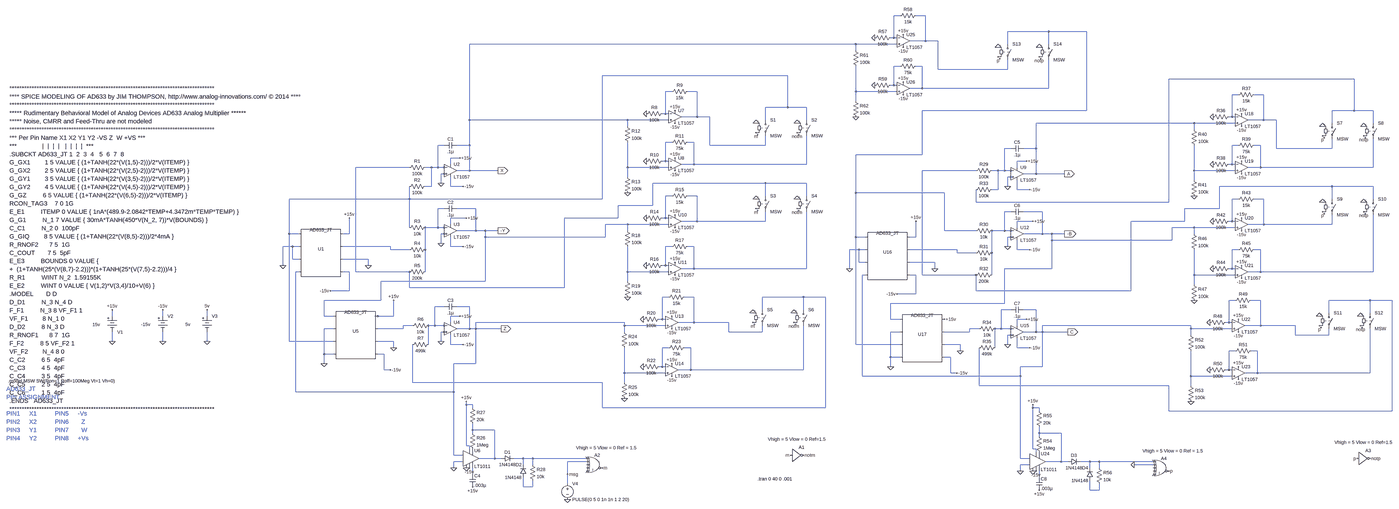
[diagram p0: schematic LORENZ_TS_Synchronize.asc, whole sheet]
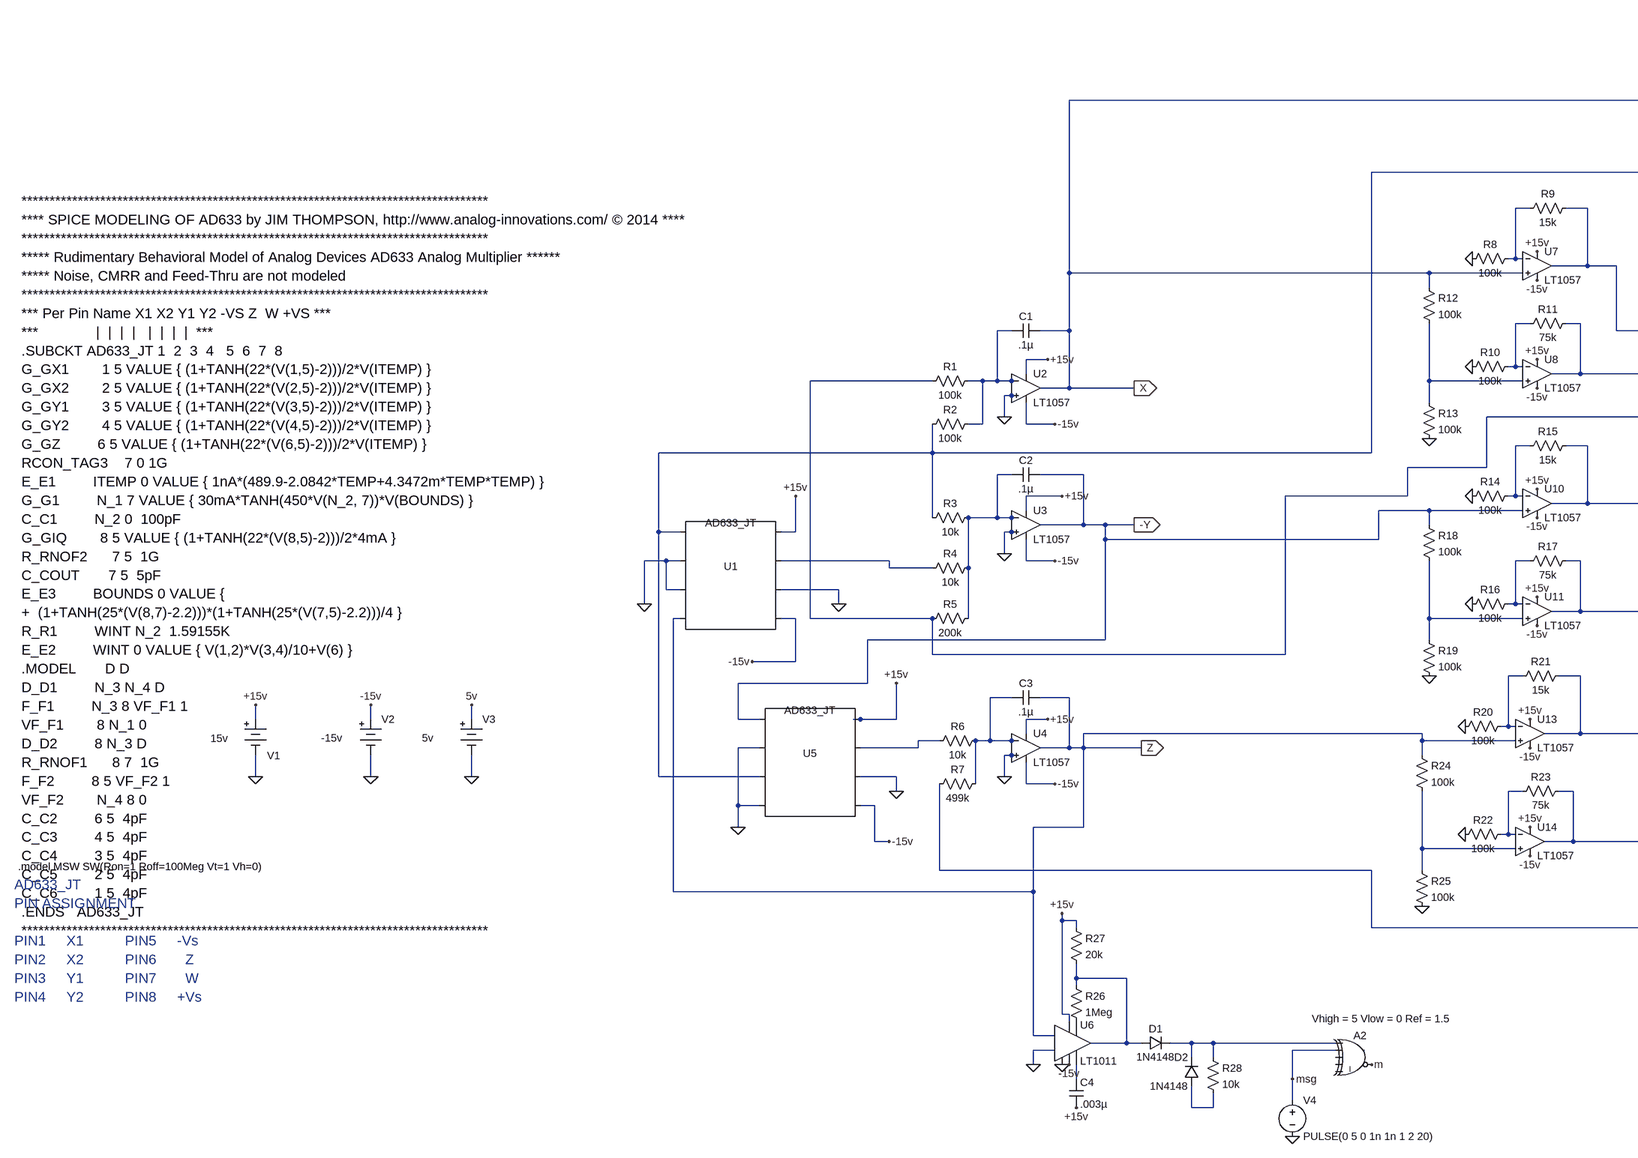
[diagram p1: schematic LORENZ_TS_Synchronize.asc, part, row 1 of 1, column 1 of 2]
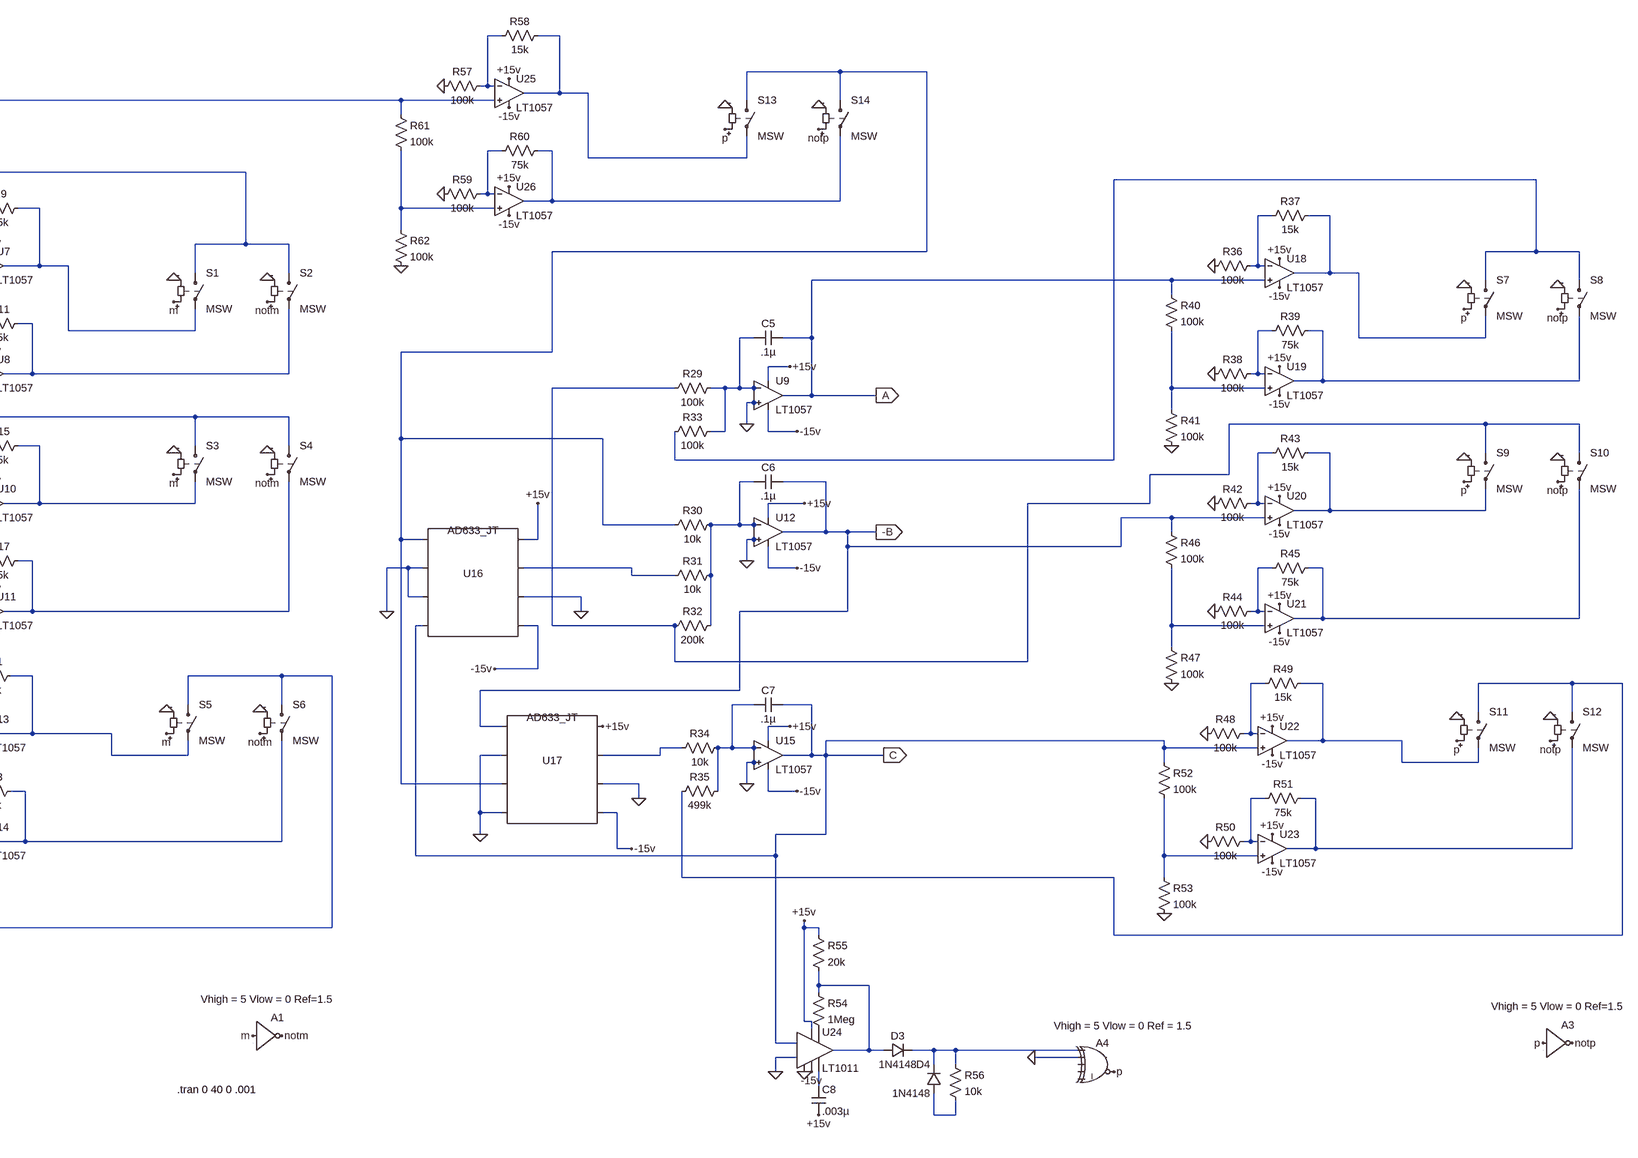
[diagram p2: schematic LORENZ_TS_Synchronize.asc, part, row 1 of 1, column 2 of 2]
LORENZ_TS_Synchronize.asc, the LTspice schematic file:
Version 4
SHEET 1 2280 3408
WIRE -336 -112 -368 -112
WIRE -208 -112 -256 -112
WIRE 416 -32 208 -32
WIRE 608 -32 416 -32
WIRE -368 0 -368 -112
WIRE -368 0 -384 0
WIRE -352 0 -368 0
WIRE -208 16 -208 -112
WIRE -208 16 -288 16
WIRE -144 16 -208 16
WIRE -560 32 -3312 32
WIRE -352 32 -560 32
WIRE 208 32 208 -32
WIRE 416 32 416 -32
WIRE -560 64 -560 32
WIRE -336 144 -368 144
WIRE -224 144 -256 144
WIRE -144 160 -144 16
WIRE 208 160 208 112
WIRE 208 160 -144 160
WIRE -1632 192 -2640 192
WIRE 2032 208 1024 208
WIRE -368 240 -368 144
WIRE -368 240 -384 240
WIRE -352 240 -368 240
WIRE -224 256 -224 144
WIRE -224 256 -288 256
WIRE 416 256 416 112
WIRE 416 256 -224 256
WIRE -2288 272 -2320 272
WIRE -2160 272 -2208 272
WIRE -560 272 -560 144
WIRE -352 272 -560 272
WIRE 1376 288 1344 288
WIRE 1504 288 1456 288
WIRE -560 320 -560 272
WIRE -1632 352 -1632 192
WIRE -1632 352 -1744 352
WIRE -1536 352 -1632 352
WIRE 608 368 608 -32
WIRE 608 368 -224 368
WIRE 2032 368 2032 208
WIRE 2032 368 1920 368
WIRE 2128 368 2032 368
WIRE -2320 384 -2320 272
WIRE -2320 384 -2336 384
WIRE -2304 384 -2320 384
WIRE -2160 400 -2160 272
WIRE -2160 400 -2240 400
WIRE -2096 400 -2160 400
WIRE 1344 400 1344 288
WIRE 1344 400 1328 400
WIRE 1360 400 1344 400
WIRE -3312 416 -3312 32
WIRE -2512 416 -3312 416
WIRE -2304 416 -2512 416
WIRE -1744 416 -1744 352
WIRE -1536 416 -1536 352
WIRE 1504 416 1504 288
WIRE 1504 416 1424 416
WIRE 1568 416 1504 416
WIRE 1152 432 352 432
WIRE 1360 432 1152 432
WIRE 1920 432 1920 368
WIRE 2128 432 2128 368
WIRE -2512 448 -2512 416
WIRE 1152 464 1152 432
WIRE -2288 528 -2320 528
WIRE -2176 528 -2208 528
WIRE -3440 544 -3472 544
WIRE -3312 544 -3312 416
WIRE -3312 544 -3376 544
WIRE -2096 544 -2096 400
WIRE -1744 544 -1744 496
WIRE -1744 544 -2096 544
WIRE 1376 544 1344 544
WIRE 1488 544 1456 544
WIRE 224 560 192 560
WIRE 352 560 352 432
WIRE 352 560 288 560
WIRE 1568 560 1568 416
WIRE 1920 560 1920 512
WIRE 1920 560 1568 560
WIRE -224 592 -224 368
WIRE -224 592 -560 592
WIRE -3360 608 -3408 608
WIRE -2320 624 -2320 528
WIRE -2320 624 -2336 624
WIRE -2304 624 -2320 624
WIRE 304 624 256 624
WIRE -3408 640 -3408 608
WIRE -2176 640 -2176 528
WIRE -2176 640 -2240 640
WIRE -1536 640 -1536 496
WIRE -1536 640 -2176 640
WIRE 1344 640 1344 544
WIRE 1344 640 1328 640
WIRE 1360 640 1344 640
WIRE -3616 656 -3888 656
WIRE -3504 656 -3536 656
WIRE -3472 656 -3472 544
WIRE -3472 656 -3504 656
WIRE -3440 656 -3472 656
WIRE -3424 656 -3440 656
WIRE -2512 656 -2512 528
WIRE -2304 656 -2512 656
WIRE 256 656 256 624
WIRE 1488 656 1488 544
WIRE 1488 656 1424 656
WIRE 2128 656 2128 512
WIRE 2128 656 1488 656
WIRE -3312 672 -3312 544
WIRE -3312 672 -3376 672
WIRE -3168 672 -3312 672
WIRE 48 672 -224 672
WIRE 160 672 128 672
WIRE 192 672 192 560
WIRE 192 672 160 672
WIRE 224 672 192 672
WIRE 240 672 224 672
WIRE 1152 672 1152 544
WIRE 1360 672 1152 672
WIRE -3440 688 -3456 688
WIRE 352 688 352 560
WIRE 352 688 288 688
WIRE 496 688 352 688
WIRE -3440 704 -3440 688
WIRE -2512 704 -2512 656
WIRE 224 704 208 704
WIRE 224 720 224 704
WIRE 1152 720 1152 672
WIRE -3456 736 -3456 688
WIRE -1744 736 -2384 736
WIRE -1536 736 -1744 736
WIRE -3504 752 -3504 656
WIRE -3504 752 -3536 752
WIRE -3408 752 -3408 704
WIRE -3344 752 -3408 752
WIRE 208 752 208 704
WIRE 1920 752 1280 752
WIRE 2128 752 1920 752
WIRE 160 768 160 672
WIRE 160 768 128 768
WIRE 256 768 256 720
WIRE 320 768 256 768
WIRE -560 784 -560 592
WIRE -112 784 -560 784
WIRE -2288 800 -2320 800
WIRE -2160 800 -2208 800
WIRE -1744 800 -1744 736
WIRE -1536 800 -1536 736
WIRE -3616 816 -3616 752
WIRE -3616 816 -4224 816
WIRE -2640 816 -2640 192
WIRE -2640 816 -3616 816
WIRE 1376 816 1344 816
WIRE 1504 816 1456 816
WIRE 1920 816 1920 752
WIRE 2128 816 2128 752
WIRE 48 832 48 768
WIRE 1024 832 1024 208
WIRE 1024 832 48 832
WIRE -2384 848 -2384 736
WIRE -2384 848 -2560 848
WIRE -3440 864 -3472 864
WIRE -3280 864 -3376 864
WIRE 1280 864 1280 752
WIRE 1280 864 1104 864
WIRE 224 880 192 880
WIRE 384 880 288 880
WIRE -3328 912 -3408 912
WIRE -2560 912 -2560 848
WIRE -2560 912 -2832 912
WIRE -2320 912 -2320 800
WIRE -2320 912 -2336 912
WIRE -2304 912 -2320 912
WIRE -2160 928 -2160 800
WIRE -2160 928 -2240 928
WIRE -1744 928 -1744 880
WIRE -1744 928 -2160 928
WIRE 336 928 256 928
WIRE 1104 928 1104 864
WIRE 1104 928 832 928
WIRE 1344 928 1344 816
WIRE 1344 928 1328 928
WIRE 1360 928 1344 928
WIRE -3408 944 -3408 912
WIRE -2512 944 -2624 944
WIRE -2304 944 -2512 944
WIRE 1504 944 1504 816
WIRE 1504 944 1424 944
WIRE 1920 944 1920 896
WIRE 1920 944 1504 944
WIRE -3616 960 -3616 816
WIRE -3472 960 -3472 864
WIRE -3472 960 -3536 960
WIRE -3440 960 -3472 960
WIRE -3424 960 -3440 960
WIRE 256 960 256 928
WIRE 1152 960 1040 960
WIRE 1360 960 1152 960
WIRE -3280 976 -3280 864
WIRE -3280 976 -3376 976
WIRE -3232 976 -3280 976
WIRE -3168 976 -3232 976
WIRE -2512 976 -2512 944
WIRE -112 976 -112 784
WIRE 48 976 -112 976
WIRE 192 976 192 880
WIRE 192 976 128 976
WIRE 224 976 192 976
WIRE 240 976 224 976
WIRE -4224 992 -4224 816
WIRE -4176 992 -4224 992
WIRE -3920 992 -3920 912
WIRE -3920 992 -3952 992
WIRE -3440 992 -3456 992
WIRE -3424 992 -3440 992
WIRE 384 992 384 880
WIRE 384 992 288 992
WIRE 432 992 384 992
WIRE 496 992 432 992
WIRE 1152 992 1152 960
WIRE -3232 1008 -3232 976
WIRE -2624 1008 -2624 944
WIRE -2624 1008 -3232 1008
WIRE -560 1008 -560 784
WIRE -512 1008 -560 1008
WIRE -256 1008 -256 928
WIRE -256 1008 -288 1008
WIRE 224 1008 208 1008
WIRE 240 1008 224 1008
WIRE 432 1024 432 992
WIRE 1040 1024 1040 960
WIRE 1040 1024 432 1024
WIRE -3456 1040 -3456 992
WIRE -4208 1056 -4256 1056
WIRE -4176 1056 -4208 1056
WIRE -3712 1056 -3952 1056
WIRE -3408 1056 -3408 1008
WIRE -3344 1056 -3408 1056
WIRE -2288 1056 -2320 1056
WIRE -2176 1056 -2208 1056
WIRE 208 1056 208 1008
WIRE -3712 1072 -3712 1056
WIRE -3616 1072 -3712 1072
WIRE -3536 1072 -3536 960
WIRE -544 1072 -592 1072
WIRE -512 1072 -544 1072
WIRE -48 1072 -288 1072
WIRE 256 1072 256 1024
WIRE 320 1072 256 1072
WIRE 1376 1072 1344 1072
WIRE 1488 1072 1456 1072
WIRE -48 1088 -48 1072
WIRE 48 1088 -48 1088
WIRE 128 1088 128 976
WIRE -4208 1120 -4208 1056
WIRE -4176 1120 -4208 1120
WIRE -3824 1120 -3952 1120
WIRE -544 1136 -544 1072
WIRE -512 1136 -544 1136
WIRE -160 1136 -288 1136
WIRE -4256 1152 -4256 1056
WIRE -3824 1152 -3824 1120
WIRE -2320 1152 -2320 1056
WIRE -2320 1152 -2336 1152
WIRE -2304 1152 -2320 1152
WIRE -2176 1168 -2176 1056
WIRE -2176 1168 -2240 1168
WIRE -1536 1168 -1536 880
WIRE -1536 1168 -2176 1168
WIRE -592 1168 -592 1072
WIRE -160 1168 -160 1136
WIRE 432 1168 432 1024
WIRE 432 1168 192 1168
WIRE 1344 1168 1344 1072
WIRE 1344 1168 1328 1168
WIRE 1360 1168 1344 1168
WIRE -4176 1184 -4192 1184
WIRE -3920 1184 -3952 1184
WIRE -3888 1184 -3888 656
WIRE -3616 1184 -3888 1184
WIRE -3536 1184 -3536 1072
WIRE -2512 1184 -2512 1056
WIRE -2304 1184 -2512 1184
WIRE 1488 1184 1488 1072
WIRE 1488 1184 1424 1184
WIRE 2128 1184 2128 896
WIRE 2128 1184 1488 1184
WIRE -512 1200 -528 1200
WIRE -256 1200 -288 1200
WIRE -224 1200 -224 672
WIRE 48 1200 -224 1200
WIRE 128 1200 128 1088
WIRE 1152 1200 1152 1072
WIRE 1360 1200 1152 1200
WIRE -3232 1232 -3232 1008
WIRE -3232 1232 -3760 1232
WIRE -2512 1232 -2512 1184
WIRE 1152 1248 1152 1200
WIRE -3616 1264 -3616 1184
WIRE -2832 1264 -2832 912
WIRE -2832 1264 -3616 1264
WIRE -3920 1280 -3920 1184
WIRE -3920 1280 -4016 1280
WIRE 48 1280 48 1200
WIRE 832 1280 832 928
WIRE 832 1280 48 1280
WIRE -256 1296 -256 1200
WIRE -256 1296 -352 1296
WIRE -2304 1312 -2336 1312
WIRE -2176 1312 -2224 1312
WIRE -1552 1312 -1760 1312
WIRE -1440 1312 -1552 1312
WIRE -3760 1328 -3760 1232
WIRE -3760 1328 -4048 1328
WIRE 1360 1328 1328 1328
WIRE 1488 1328 1440 1328
WIRE 2112 1328 1904 1328
WIRE 2224 1328 2112 1328
WIRE 192 1344 192 1168
WIRE 192 1344 -384 1344
WIRE -3440 1360 -3488 1360
WIRE -3312 1360 -3376 1360
WIRE -1760 1376 -1760 1312
WIRE -1552 1376 -1552 1312
WIRE 224 1376 176 1376
WIRE 352 1376 288 1376
WIRE 1904 1392 1904 1328
WIRE 2112 1392 2112 1328
WIRE -5120 1408 -5120 1376
WIRE -4864 1408 -4864 1376
WIRE -4640 1408 -4640 1376
WIRE -4048 1408 -4048 1328
WIRE -4000 1408 -4048 1408
WIRE -3776 1408 -3792 1408
WIRE -3696 1408 -3696 1328
WIRE -3696 1408 -3776 1408
WIRE -3360 1408 -3408 1408
WIRE -2336 1424 -2336 1312
WIRE -2336 1424 -2352 1424
WIRE -2320 1424 -2336 1424
WIRE -384 1424 -384 1344
WIRE -336 1424 -384 1424
WIRE 304 1424 256 1424
WIRE -3408 1440 -3408 1408
WIRE -2528 1440 -3280 1440
WIRE -2176 1440 -2176 1312
WIRE -2176 1440 -2256 1440
WIRE -2000 1440 -2176 1440
WIRE 1328 1440 1328 1328
WIRE 1328 1440 1312 1440
WIRE 1344 1440 1328 1440
WIRE -3600 1456 -3648 1456
WIRE -3488 1456 -3488 1360
WIRE -3488 1456 -3520 1456
WIRE -3440 1456 -3488 1456
WIRE -3424 1456 -3440 1456
WIRE -2528 1456 -2528 1440
WIRE -2320 1456 -2528 1456
WIRE 256 1456 256 1424
WIRE 1136 1456 384 1456
WIRE 1488 1456 1488 1328
WIRE 1488 1456 1408 1456
WIRE 1664 1456 1488 1456
WIRE -4000 1472 -4048 1472
WIRE -3648 1472 -3648 1456
WIRE -3648 1472 -3776 1472
WIRE -3312 1472 -3312 1360
WIRE -3312 1472 -3376 1472
WIRE -3280 1472 -3280 1440
WIRE -3280 1472 -3312 1472
WIRE -3152 1472 -3280 1472
WIRE 64 1472 16 1472
WIRE 176 1472 176 1376
WIRE 176 1472 144 1472
WIRE 224 1472 176 1472
WIRE 240 1472 224 1472
WIRE 1136 1472 1136 1456
WIRE 1344 1472 1136 1472
WIRE -3440 1488 -3456 1488
WIRE -3424 1488 -3440 1488
WIRE -2528 1488 -2528 1456
WIRE -2000 1488 -2000 1440
WIRE -1760 1488 -1760 1456
WIRE -1760 1488 -2000 1488
WIRE -336 1488 -384 1488
WIRE 16 1488 16 1472
WIRE 16 1488 -112 1488
WIRE 352 1488 352 1376
WIRE 352 1488 288 1488
WIRE 384 1488 384 1456
WIRE 384 1488 352 1488
WIRE 512 1488 384 1488
WIRE 224 1504 208 1504
WIRE 240 1504 224 1504
WIRE 1136 1504 1136 1472
WIRE 1664 1504 1664 1456
WIRE 1904 1504 1904 1472
WIRE 1904 1504 1664 1504
WIRE -5120 1536 -5120 1488
WIRE -4864 1536 -4864 1488
WIRE -4640 1536 -4640 1488
WIRE -4224 1536 -4224 992
WIRE -4000 1536 -4224 1536
WIRE -3696 1536 -3776 1536
WIRE -3456 1536 -3456 1488
WIRE -3520 1552 -3520 1456
WIRE -3408 1552 -3408 1504
WIRE -3344 1552 -3408 1552
WIRE -560 1552 -560 1008
WIRE -336 1552 -560 1552
WIRE -32 1552 -112 1552
WIRE 208 1552 208 1504
WIRE -3696 1568 -3696 1536
WIRE -2304 1568 -2336 1568
WIRE -2192 1568 -2224 1568
WIRE 144 1568 144 1472
WIRE 256 1568 256 1520
WIRE 320 1568 256 1568
WIRE -32 1584 -32 1552
WIRE 1360 1584 1328 1584
WIRE 1472 1584 1440 1584
WIRE -4048 1600 -4048 1472
WIRE -4000 1600 -4048 1600
WIRE -3744 1600 -3776 1600
WIRE -384 1616 -384 1488
WIRE -336 1616 -384 1616
WIRE -80 1616 -112 1616
WIRE -4048 1648 -4048 1600
WIRE -3280 1648 -3280 1472
WIRE -3280 1648 -3392 1648
WIRE -2336 1664 -2336 1568
WIRE -2336 1664 -2352 1664
WIRE -2320 1664 -2336 1664
WIRE -384 1664 -384 1616
WIRE 384 1664 384 1488
WIRE 384 1664 272 1664
WIRE -3744 1680 -3744 1600
WIRE -3712 1680 -3744 1680
WIRE -2192 1680 -2192 1568
WIRE -2192 1680 -2256 1680
WIRE -1552 1680 -1552 1456
WIRE -1552 1680 -2192 1680
WIRE 1328 1680 1328 1584
WIRE 1328 1680 1312 1680
WIRE 1344 1680 1328 1680
WIRE -2528 1696 -2528 1568
WIRE -2320 1696 -2528 1696
WIRE -80 1696 -80 1616
WIRE -48 1696 -80 1696
WIRE 1472 1696 1472 1584
WIRE 1472 1696 1408 1696
WIRE 2112 1696 2112 1472
WIRE 2112 1696 1472 1696
WIRE -528 1712 -528 1200
WIRE 272 1712 272 1664
WIRE 272 1712 -528 1712
WIRE 1136 1712 1136 1584
WIRE 1344 1712 1136 1712
WIRE -3600 1744 -3600 1552
WIRE -2640 1744 -3600 1744
WIRE -2528 1744 -2528 1696
WIRE 64 1760 64 1568
WIRE 1024 1760 64 1760
WIRE 1136 1760 1136 1712
WIRE -4192 1792 -4192 1184
WIRE -3392 1792 -3392 1648
WIRE -3392 1792 -4192 1792
WIRE -3328 1856 -3328 1840
WIRE -3296 1856 -3328 1856
WIRE -3296 1872 -3296 1856
WIRE -2640 1872 -2640 1744
WIRE -1440 1872 -1440 1312
WIRE -1440 1872 -2640 1872
WIRE 336 1872 336 1856
WIRE 368 1872 336 1872
WIRE 368 1888 368 1872
WIRE 1024 1888 1024 1760
WIRE 2224 1888 2224 1328
WIRE 2224 1888 1024 1888
WIRE -3296 1984 -3296 1952
WIRE -3184 1984 -3296 1984
WIRE -3296 2000 -3296 1984
WIRE 368 2000 368 1968
WIRE 480 2000 368 2000
WIRE 368 2016 368 2000
WIRE -3328 2064 -3328 1856
WIRE -3312 2064 -3328 2064
WIRE -3312 2080 -3312 2064
WIRE 336 2080 336 1872
WIRE 352 2080 336 2080
WIRE 352 2096 352 2080
WIRE -3392 2112 -3392 1792
WIRE -3344 2112 -3392 2112
WIRE -3184 2128 -3184 1984
WIRE -3184 2128 -3264 2128
WIRE -3152 2128 -3184 2128
WIRE -3040 2128 -3088 2128
WIRE -2992 2128 -3040 2128
WIRE -2720 2128 -2992 2128
WIRE 272 2128 272 1712
WIRE 320 2128 272 2128
WIRE -3344 2144 -3392 2144
WIRE -2720 2144 -2816 2144
WIRE 480 2144 480 2000
WIRE 480 2144 400 2144
WIRE 512 2144 480 2144
WIRE 624 2144 576 2144
WIRE 672 2144 624 2144
WIRE 944 2144 672 2144
WIRE -3040 2160 -3040 2128
WIRE -2992 2160 -2992 2128
WIRE 320 2160 272 2160
WIRE 944 2160 848 2160
WIRE -3392 2176 -3392 2144
WIRE 624 2176 624 2144
WIRE 672 2176 672 2144
WIRE 272 2192 272 2160
WIRE -3296 2208 -3296 2176
WIRE -2816 2208 -2816 2144
WIRE 368 2224 368 2192
WIRE -2816 2256 -2816 2208
WIRE -3040 2272 -3040 2224
WIRE -2992 2272 -2992 2240
WIRE -2992 2272 -3040 2272
WIRE 624 2288 624 2240
WIRE 672 2288 672 2256
WIRE 672 2288 624 2288
FLAG -3168 672 X
IOPIN -3168 672 Out
FLAG -3152 1472 Z
IOPIN -3152 1472 Out
FLAG -3456 736 0
FLAG -3456 1040 0
FLAG -3456 1536 0
FLAG -5120 1536 0
FLAG -4864 1536 0
FLAG -3168 976 -Y
IOPIN -3168 976 Out
FLAG -5120 1376 +15v
FLAG -3360 1408 +15v
FLAG -3328 912 +15v
FLAG -3360 608 +15v
FLAG -4864 1376 -15v
FLAG -3344 1552 -15v
FLAG -3344 1056 -15v
FLAG -3344 752 -15v
FLAG -3920 912 +15v
FLAG -3696 1328 +15v
FLAG -3712 1680 -15v
FLAG -4016 1280 -15v
FLAG -3696 1568 0
FLAG -3824 1152 0
FLAG -4256 1152 0
FLAG -4048 1648 0
FLAG -4640 1536 0
FLAG -4640 1376 5v
FLAG -2272 608 +15v
FLAG -2272 368 +15v
FLAG -2272 672 -15v
FLAG -2272 432 -15v
FLAG -2416 624 0
FLAG -2416 384 0
FLAG -2512 784 0
FLAG -2816 2336 0
FLAG -2272 1136 +15v
FLAG -2272 896 +15v
FLAG -2272 1200 -15v
FLAG -2272 960 -15v
FLAG -2416 1152 0
FLAG -2416 912 0
FLAG -2512 1312 0
FLAG -2288 1648 +15v
FLAG -2288 1408 +15v
FLAG -2288 1712 -15v
FLAG -2288 1472 -15v
FLAG -2432 1664 0
FLAG -2432 1424 0
FLAG -2528 1824 0
FLAG -1616 2112 m
FLAG -1552 2112 notm
FLAG -1792 432 0
FLAG -1584 432 0
FLAG -1792 480 m
FLAG -1584 480 notm
FLAG -1792 816 0
FLAG -1584 816 0
FLAG -1792 864 m
FLAG -1584 864 notm
FLAG -1808 1392 0
FLAG -1600 1392 0
FLAG -1808 1440 m
FLAG -1600 1440 notm
FLAG -3328 1840 +15v
FLAG -3312 2176 -15v
FLAG -3296 2272 +15v
FLAG -3328 2176 0
FLAG -3392 2176 0
FLAG -2640 2176 m
FLAG 496 688 A
IOPIN 496 688 Out
FLAG 512 1488 C
IOPIN 512 1488 Out
FLAG 208 752 0
FLAG 208 1056 0
FLAG 208 1552 0
FLAG 496 992 -B
IOPIN 496 992 Out
FLAG 304 1424 +15v
FLAG 336 928 +15v
FLAG 304 624 +15v
FLAG 320 1568 -15v
FLAG 320 1072 -15v
FLAG 320 768 -15v
FLAG -256 928 +15v
FLAG -48 1696 -15v
FLAG -352 1296 -15v
FLAG -32 1584 0
FLAG -160 1168 0
FLAG -592 1168 0
FLAG -384 1664 0
FLAG 1392 624 +15v
FLAG 1392 384 +15v
FLAG 1392 688 -15v
FLAG 1392 448 -15v
FLAG 1248 640 0
FLAG 1248 400 0
FLAG 1152 800 0
FLAG 1392 1152 +15v
FLAG 1392 912 +15v
FLAG 1392 1216 -15v
FLAG 1392 976 -15v
FLAG 1248 1168 0
FLAG 1248 928 0
FLAG 1152 1328 0
FLAG 1376 1664 +15v
FLAG 1376 1424 +15v
FLAG 1376 1728 -15v
FLAG 1376 1488 -15v
FLAG 1232 1680 0
FLAG 1232 1440 0
FLAG 1136 1840 0
FLAG 2048 2128 p
FLAG 2112 2128 notp
FLAG 1872 448 0
FLAG 2080 448 0
FLAG 1872 496 p
FLAG 2080 496 notp
FLAG 1872 832 0
FLAG 2080 832 0
FLAG 1872 880 p
FLAG 2080 880 notp
FLAG 1856 1408 0
FLAG 2064 1408 0
FLAG 1856 1456 p
FLAG 2064 1456 notp
FLAG 336 1856 +15v
FLAG 352 2192 -15v
FLAG 368 2288 +15v
FLAG 336 2192 0
FLAG 272 2192 0
FLAG 1024 2192 p
FLAG 848 2160 0
FLAG -320 224 +15v
FLAG -320 -16 +15v
FLAG -320 288 -15v
FLAG -320 48 -15v
FLAG -464 240 0
FLAG -464 0 0
FLAG -560 400 0
FLAG 160 48 0
FLAG 368 48 0
FLAG 160 96 p
FLAG 368 96 notp
FLAG -112 1424 +15v
FLAG -2816 2208 msg
SYMBOL Opamps\\LT1057 -3408 608 R0
SYMATTR InstName U2
SYMBOL Opamps\\LT1057 -3408 912 R0
SYMATTR InstName U3
SYMBOL Opamps\\LT1057 -3408 1408 R0
SYMATTR InstName U4
SYMBOL res -3632 672 R270
WINDOW 0 32 56 VTop 2
WINDOW 3 0 56 VBottom 2
SYMATTR InstName R1
SYMATTR Value 100k
SYMATTR SpiceLine tol=1
SYMBOL res -3632 976 R270
WINDOW 0 32 56 VTop 2
WINDOW 3 0 56 VBottom 2
SYMATTR InstName R3
SYMATTR Value 10k
SYMATTR SpiceLine tol=1
SYMBOL res -3632 1088 R270
WINDOW 0 32 56 VTop 2
WINDOW 3 0 56 VBottom 2
SYMATTR InstName R4
SYMATTR Value 10k
SYMATTR SpiceLine tol=1
SYMBOL res -3632 1200 R270
WINDOW 0 32 56 VTop 2
WINDOW 3 0 56 VBottom 2
SYMATTR InstName R5
SYMATTR Value 200k
SYMATTR SpiceLine tol=1
SYMBOL res -3632 768 R270
WINDOW 0 32 56 VTop 2
WINDOW 3 0 56 VBottom 2
SYMATTR InstName R2
SYMATTR Value 100k
SYMATTR SpiceLine tol=1
SYMBOL cap -3440 560 R270
WINDOW 0 32 32 VTop 2
WINDOW 3 0 32 VBottom 2
SYMATTR InstName C1
SYMATTR Value .1µ
SYMBOL cap -3440 880 R270
WINDOW 0 32 32 VTop 2
WINDOW 3 0 32 VBottom 2
SYMATTR InstName C2
SYMATTR Value .1µ
SYMBOL cap -3440 1376 R270
WINDOW 0 32 32 VTop 2
WINDOW 3 0 32 VBottom 2
SYMATTR InstName C3
SYMATTR Value .1µ
SYMBOL res -3616 1472 R270
WINDOW 0 32 56 VTop 2
WINDOW 3 0 56 VBottom 2
SYMATTR InstName R6
SYMATTR Value 10k
SYMATTR SpiceLine tol=1
SYMBOL res -3616 1568 R270
WINDOW 0 32 56 VTop 2
WINDOW 3 0 56 VBottom 2
SYMATTR InstName R7
SYMATTR Value 499k
SYMATTR SpiceLine tol=1
SYMBOL Misc\\battery -5120 1392 R0
WINDOW 0 26 97 Left 2
WINDOW 3 -100 59 Left 2
WINDOW 123 0 0 Left 2
WINDOW 39 0 0 Left 2
SYMATTR InstName V1
SYMATTR Value 15v
SYMBOL Misc\\battery -4864 1392 R0
WINDOW 3 -110 58 Left 2
WINDOW 123 0 0 Left 2
WINDOW 39 0 0 Left 2
SYMATTR Value -15v
SYMATTR InstName V2
SYMBOL Misc\\DIP8 -4064 1088 R0
WINDOW 3 0 -116 Center 2
SYMATTR Value AD633_JT
SYMATTR InstName U1
SYMBOL Misc\\DIP8 -3888 1504 R0
WINDOW 3 0 -116 Center 2
SYMATTR Value AD633_JT
SYMATTR InstName U5
SYMBOL Misc\\battery -4640 1392 R0
WINDOW 3 -110 58 Left 2
WINDOW 123 0 0 Left 2
WINDOW 39 0 0 Left 2
SYMATTR Value 5v
SYMATTR InstName V3
SYMBOL Opamps\\LT1057 -2272 336 R0
SYMATTR InstName U7
SYMBOL Opamps\\LT1057 -2272 576 R0
SYMATTR InstName U8
SYMBOL res -2320 368 R90
WINDOW 0 0 56 VBottom 2
WINDOW 3 32 56 VTop 2
SYMATTR InstName R8
SYMATTR Value 100k
SYMBOL res -2192 256 R90
WINDOW 0 0 56 VBottom 2
WINDOW 3 32 56 VTop 2
SYMATTR InstName R9
SYMATTR Value 15k
SYMBOL res -2320 608 R90
WINDOW 0 0 56 VBottom 2
WINDOW 3 32 56 VTop 2
SYMATTR InstName R10
SYMATTR Value 100k
SYMBOL res -2192 512 R90
WINDOW 0 0 56 VBottom 2
WINDOW 3 32 56 VTop 2
SYMATTR InstName R11
SYMATTR Value 75k
SYMBOL res -2528 432 R0
SYMATTR InstName R12
SYMATTR Value 100k
SYMBOL res -2528 688 R0
SYMATTR InstName R13
SYMATTR Value 100k
SYMBOL voltage -2816 2240 R0
WINDOW 123 0 0 Left 2
WINDOW 39 0 0 Left 2
SYMATTR InstName V4
SYMATTR Value PULSE(0 5 0 1n 1n 1 2 20)
SYMBOL Opamps\\LT1057 -2272 864 R0
SYMATTR InstName U10
SYMBOL Opamps\\LT1057 -2272 1104 R0
SYMATTR InstName U11
SYMBOL res -2320 896 R90
WINDOW 0 0 56 VBottom 2
WINDOW 3 32 56 VTop 2
SYMATTR InstName R14
SYMATTR Value 100k
SYMBOL res -2192 784 R90
WINDOW 0 0 56 VBottom 2
WINDOW 3 32 56 VTop 2
SYMATTR InstName R15
SYMATTR Value 15k
SYMBOL res -2320 1136 R90
WINDOW 0 0 56 VBottom 2
WINDOW 3 32 56 VTop 2
SYMATTR InstName R16
SYMATTR Value 100k
SYMBOL res -2192 1040 R90
WINDOW 0 0 56 VBottom 2
WINDOW 3 32 56 VTop 2
SYMATTR InstName R17
SYMATTR Value 75k
SYMBOL res -2528 960 R0
SYMATTR InstName R18
SYMATTR Value 100k
SYMBOL res -2528 1216 R0
SYMATTR InstName R19
SYMATTR Value 100k
SYMBOL Opamps\\LT1057 -2288 1376 R0
SYMATTR InstName U13
SYMBOL Opamps\\LT1057 -2288 1616 R0
SYMATTR InstName U14
SYMBOL res -2336 1408 R90
WINDOW 0 0 56 VBottom 2
WINDOW 3 32 56 VTop 2
SYMATTR InstName R20
SYMATTR Value 100k
SYMBOL res -2208 1296 R90
WINDOW 0 0 56 VBottom 2
WINDOW 3 32 56 VTop 2
SYMATTR InstName R21
SYMATTR Value 15k
SYMBOL res -2336 1648 R90
WINDOW 0 0 56 VBottom 2
WINDOW 3 32 56 VTop 2
SYMATTR InstName R22
SYMATTR Value 100k
SYMBOL res -2208 1552 R90
WINDOW 0 0 56 VBottom 2
WINDOW 3 32 56 VTop 2
SYMATTR InstName R23
SYMATTR Value 75k
SYMBOL res -2544 1472 R0
SYMATTR InstName R24
SYMATTR Value 100k
SYMBOL res -2544 1728 R0
SYMATTR InstName R25
SYMATTR Value 100k
SYMBOL sw -1744 400 R0
SYMATTR InstName S1
SYMATTR Value MSW
SYMBOL Digital\\inv -1616 2048 R0
WINDOW 3 -116 -17 Left 2
SYMATTR Value Vhigh = 5 Vlow = 0 Ref=1.5
SYMATTR InstName A1
SYMATTR Value2 Trise = 1n Tfall = 1n Td =1n
SYMBOL sw -1536 400 R0
SYMATTR InstName S2
SYMATTR Value MSW
SYMBOL sw -1744 784 R0
SYMATTR InstName S3
SYMATTR Value MSW
SYMBOL sw -1536 784 R0
SYMATTR InstName S4
SYMATTR Value MSW
SYMBOL sw -1760 1360 R0
SYMATTR InstName S5
SYMATTR Value MSW
SYMBOL sw -1552 1360 R0
SYMATTR InstName S6
SYMATTR Value MSW
SYMBOL Comparators\\LT1011 -3312 2128 R0
SYMATTR InstName U6
SYMBOL res -3312 1984 R0
SYMATTR InstName R26
SYMATTR Value 1Meg
SYMBOL res -3312 1856 R0
SYMATTR InstName R27
SYMATTR Value 20k
SYMBOL cap -3312 2208 R0
SYMATTR InstName C4
SYMATTR Value .003µ
SYMBOL diode -3152 2144 R270
WINDOW 0 32 32 VTop 2
WINDOW 3 0 32 VBottom 2
SYMATTR InstName D1
SYMATTR Value 1N4148
SYMBOL diode -3024 2224 R180
WINDOW 0 24 64 Left 2
WINDOW 3 24 0 Left 2
SYMATTR InstName D2
SYMATTR Value 1N4148
SYMBOL res -3008 2144 R0
SYMATTR InstName R28
SYMATTR Value 10k
SYMBOL Digital\\xor -2672 2096 R0
WINDOW 3 -101 -22 Left 2
SYMATTR Value Vhigh = 5 Vlow = 0 Ref = 1.5
SYMATTR InstName A2
SYMBOL Opamps\\LT1057 256 624 R0
SYMATTR InstName U9
SYMBOL Opamps\\LT1057 256 928 R0
SYMATTR InstName U12
SYMBOL Opamps\\LT1057 256 1424 R0
SYMATTR InstName U15
SYMBOL res 32 688 R270
WINDOW 0 32 56 VTop 2
WINDOW 3 0 56 VBottom 2
SYMATTR InstName R29
SYMATTR Value 100k
SYMATTR SpiceLine tol=1
SYMBOL res 32 992 R270
WINDOW 0 32 56 VTop 2
WINDOW 3 0 56 VBottom 2
SYMATTR InstName R30
SYMATTR Value 10k
SYMATTR SpiceLine tol=1
SYMBOL res 32 1104 R270
WINDOW 0 32 56 VTop 2
WINDOW 3 0 56 VBottom 2
SYMATTR InstName R31
SYMATTR Value 10k
SYMATTR SpiceLine tol=1
SYMBOL res 32 1216 R270
WINDOW 0 32 56 VTop 2
WINDOW 3 0 56 VBottom 2
SYMATTR InstName R32
SYMATTR Value 200k
SYMATTR SpiceLine tol=1
SYMBOL res 32 784 R270
WINDOW 0 32 56 VTop 2
WINDOW 3 0 56 VBottom 2
SYMATTR InstName R33
SYMATTR Value 100k
SYMATTR SpiceLine tol=1
SYMBOL cap 224 576 R270
WINDOW 0 32 32 VTop 2
WINDOW 3 0 32 VBottom 2
SYMATTR InstName C5
SYMATTR Value .1µ
SYMBOL cap 224 896 R270
WINDOW 0 32 32 VTop 2
WINDOW 3 0 32 VBottom 2
SYMATTR InstName C6
SYMATTR Value .1µ
SYMBOL cap 224 1392 R270
WINDOW 0 32 32 VTop 2
WINDOW 3 0 32 VBottom 2
SYMATTR InstName C7
SYMATTR Value .1µ
SYMBOL res 48 1488 R270
WINDOW 0 32 56 VTop 2
WINDOW 3 0 56 VBottom 2
SYMATTR InstName R34
SYMATTR Value 10k
SYMATTR SpiceLine tol=1
SYMBOL res 48 1584 R270
WINDOW 0 32 56 VTop 2
WINDOW 3 0 56 VBottom 2
SYMATTR InstName R35
SYMATTR Value 499k
SYMATTR SpiceLine tol=1
SYMBOL Misc\\DIP8 -400 1104 R0
WINDOW 3 0 -116 Center 2
SYMATTR Value AD633_JT
SYMATTR InstName U16
SYMBOL Misc\\DIP8 -224 1520 R0
WINDOW 3 0 -116 Center 2
SYMATTR Value AD633_JT
SYMATTR InstName U17
SYMBOL Opamps\\LT1057 1392 352 R0
SYMATTR InstName U18
SYMBOL Opamps\\LT1057 1392 592 R0
SYMATTR InstName U19
SYMBOL res 1344 384 R90
WINDOW 0 0 56 VBottom 2
WINDOW 3 32 56 VTop 2
SYMATTR InstName R36
SYMATTR Value 100k
SYMBOL res 1472 272 R90
WINDOW 0 0 56 VBottom 2
WINDOW 3 32 56 VTop 2
SYMATTR InstName R37
SYMATTR Value 15k
SYMBOL res 1344 624 R90
WINDOW 0 0 56 VBottom 2
WINDOW 3 32 56 VTop 2
SYMATTR InstName R38
SYMATTR Value 100k
SYMBOL res 1472 528 R90
WINDOW 0 0 56 VBottom 2
WINDOW 3 32 56 VTop 2
SYMATTR InstName R39
SYMATTR Value 75k
SYMBOL res 1136 448 R0
SYMATTR InstName R40
SYMATTR Value 100k
SYMBOL res 1136 704 R0
SYMATTR InstName R41
SYMATTR Value 100k
SYMBOL Opamps\\LT1057 1392 880 R0
SYMATTR InstName U20
SYMBOL Opamps\\LT1057 1392 1120 R0
SYMATTR InstName U21
SYMBOL res 1344 912 R90
WINDOW 0 0 56 VBottom 2
WINDOW 3 32 56 VTop 2
SYMATTR InstName R42
SYMATTR Value 100k
SYMBOL res 1472 800 R90
WINDOW 0 0 56 VBottom 2
WINDOW 3 32 56 VTop 2
SYMATTR InstName R43
SYMATTR Value 15k
SYMBOL res 1344 1152 R90
WINDOW 0 0 56 VBottom 2
WINDOW 3 32 56 VTop 2
SYMATTR InstName R44
SYMATTR Value 100k
SYMBOL res 1472 1056 R90
WINDOW 0 0 56 VBottom 2
WINDOW 3 32 56 VTop 2
SYMATTR InstName R45
SYMATTR Value 75k
SYMBOL res 1136 976 R0
SYMATTR InstName R46
SYMATTR Value 100k
SYMBOL res 1136 1232 R0
SYMATTR InstName R47
SYMATTR Value 100k
SYMBOL Opamps\\LT1057 1376 1392 R0
SYMATTR InstName U22
SYMBOL Opamps\\LT1057 1376 1632 R0
SYMATTR InstName U23
SYMBOL res 1328 1424 R90
WINDOW 0 0 56 VBottom 2
WINDOW 3 32 56 VTop 2
SYMATTR InstName R48
SYMATTR Value 100k
SYMBOL res 1456 1312 R90
WINDOW 0 0 56 VBottom 2
WINDOW 3 32 56 VTop 2
SYMATTR InstName R49
SYMATTR Value 15k
SYMBOL res 1328 1664 R90
WINDOW 0 0 56 VBottom 2
WINDOW 3 32 56 VTop 2
SYMATTR InstName R50
SYMATTR Value 100k
SYMBOL res 1456 1568 R90
WINDOW 0 0 56 VBottom 2
WINDOW 3 32 56 VTop 2
SYMATTR InstName R51
SYMATTR Value 75k
SYMBOL res 1120 1488 R0
SYMATTR InstName R52
SYMATTR Value 100k
SYMBOL res 1120 1744 R0
SYMATTR InstName R53
SYMATTR Value 100k
SYMBOL sw 1920 416 R0
SYMATTR InstName S7
SYMATTR Value MSW
SYMBOL Digital\\inv 2048 2064 R0
WINDOW 3 -116 -17 Left 2
SYMATTR Value Vhigh = 5 Vlow = 0 Ref=1.5
SYMATTR InstName A3
SYMATTR Value2 Trise = 1n Tfall = 1n Td =1n
SYMBOL sw 2128 416 R0
SYMATTR InstName S8
SYMATTR Value MSW
SYMBOL sw 1920 800 R0
SYMATTR InstName S9
SYMATTR Value MSW
SYMBOL sw 2128 800 R0
SYMATTR InstName S10
SYMATTR Value MSW
SYMBOL sw 1904 1376 R0
SYMATTR InstName S11
SYMATTR Value MSW
SYMBOL sw 2112 1376 R0
SYMATTR InstName S12
SYMATTR Value MSW
SYMBOL Comparators\\LT1011 352 2144 R0
SYMATTR InstName U24
SYMBOL res 352 2000 R0
SYMATTR InstName R54
SYMATTR Value 1Meg
SYMBOL res 352 1872 R0
SYMATTR InstName R55
SYMATTR Value 20k
SYMBOL cap 352 2224 R0
SYMATTR InstName C8
SYMATTR Value .003µ
SYMBOL diode 512 2160 R270
WINDOW 0 32 32 VTop 2
WINDOW 3 0 32 VBottom 2
SYMATTR InstName D3
SYMATTR Value 1N4148
SYMBOL diode 640 2240 R180
WINDOW 0 24 64 Left 2
WINDOW 3 24 0 Left 2
SYMATTR InstName D4
SYMATTR Value 1N4148
SYMBOL res 656 2160 R0
SYMATTR InstName R56
SYMATTR Value 10k
SYMBOL Digital\\xor 992 2112 R0
WINDOW 3 -101 -22 Left 2
SYMATTR Value Vhigh = 5 Vlow = 0 Ref = 1.5
SYMATTR InstName A4
SYMBOL Opamps\\LT1057 -320 -48 R0
SYMATTR InstName U25
SYMBOL Opamps\\LT1057 -320 192 R0
SYMATTR InstName U26
SYMBOL res -368 -16 R90
WINDOW 0 0 56 VBottom 2
WINDOW 3 32 56 VTop 2
SYMATTR InstName R57
SYMATTR Value 100k
SYMBOL res -240 -128 R90
WINDOW 0 0 56 VBottom 2
WINDOW 3 32 56 VTop 2
SYMATTR InstName R58
SYMATTR Value 15k
SYMBOL res -368 224 R90
WINDOW 0 0 56 VBottom 2
WINDOW 3 32 56 VTop 2
SYMATTR InstName R59
SYMATTR Value 100k
SYMBOL res -240 128 R90
WINDOW 0 0 56 VBottom 2
WINDOW 3 32 56 VTop 2
SYMATTR InstName R60
SYMATTR Value 75k
SYMBOL res -576 48 R0
SYMATTR InstName R61
SYMATTR Value 100k
SYMBOL res -576 304 R0
SYMATTR InstName R62
SYMATTR Value 100k
SYMBOL sw 208 16 R0
SYMATTR InstName S13
SYMATTR Value MSW
SYMBOL sw 416 16 R0
SYMATTR InstName S14
SYMATTR Value MSW
TEXT -1784 2232 Left 2 !.tran 0 40 0 .001
TEXT -5640 256 Left 3 !***********************************************************************************\n**** SPICE MODELING OF AD633 by JIM THOMPSON, http://www.analog-innovations.com/ © 2014 ****\n***********************************************************************************\n***** Rudimentary Behavioral Model of Analog Devices AD633 Analog Multiplier ******\n***** Noise, CMRR and Feed-Thru are not modeled\n***********************************************************************************\n*** Per Pin Name X1 X2 Y1 Y2 -VS Z  W +VS ***\n***              |  |  |  |   |  |  |  |  ***\n.SUBCKT AD633_JT 1  2  3  4   5  6  7  8 \nG_GX1        1 5 VALUE { (1+TANH(22*(V(1,5)-2)))/2*V(ITEMP) }\nG_GX2        2 5 VALUE { (1+TANH(22*(V(2,5)-2)))/2*V(ITEMP) }\nG_GY1        3 5 VALUE { (1+TANH(22*(V(3,5)-2)))/2*V(ITEMP) }\nG_GY2        4 5 VALUE { (1+TANH(22*(V(4,5)-2)))/2*V(ITEMP) }\nG_GZ         6 5 VALUE { (1+TANH(22*(V(6,5)-2)))/2*V(ITEMP) }\nRCON_TAG3    7 0 1G\nE_E1         ITEMP 0 VALUE { 1nA*(489.9-2.0842*TEMP+4.3472m*TEMP*TEMP) }\nG_G1         N_1 7 VALUE { 30mA*TANH(450*V(N_2, 7))*V(BOUNDS) }\nC_C1         N_2 0  100pF \nG_GIQ        8 5 VALUE { (1+TANH(22*(V(8,5)-2)))/2*4mA }\nR_RNOF2      7 5  1G \nC_COUT       7 5  5pF \nE_E3         BOUNDS 0 VALUE {\n+  (1+TANH(25*(V(8,7)-2.2)))*(1+TANH(25*(V(7,5)-2.2)))/4 }\nR_R1         WINT N_2  1.59155K \nE_E2         WINT 0 VALUE { V(1,2)*V(3,4)/10+V(6) }\n.MODEL       D D\nD_D1         N_3 N_4 D \nF_F1         N_3 8 VF_F1 1\nVF_F1        8 N_1 0\nD_D2         8 N_3 D \nR_RNOF1      8 7  1G \nF_F2         8 5 VF_F2 1\nVF_F2        N_4 8 0\nC_C2         6 5  4pF \nC_C3         4 5  4pF \nC_C4         3 5  4pF \nC_C5         2 5  4pF \nC_C6         1 5  4pF \n.ENDS   AD633_JT\n***********************************************************************************
TEXT -5656 1776 Left 3 ;AD633_JT\nPIN ASSIGNMENT\n \nPIN1     X1          PIN5     -Vs\nPIN2     X2          PIN6       Z\nPIN3     Y1          PIN7       W\nPIN4     Y2          PIN8     +Vs
TEXT -5648 1736 Left 2 !.model MSW SW(Ron=1 Roff=100Meg Vt=1 Vh=0)

The netlist it stands for:
* LORENZ_TS_Synchronize.asc
XU2 0 N015 +15v -15v X LT1057  ; pins In+ In- V+ V- OUT
XU3 0 N027 +15v -15v -Y LT1057  ; pins In+ In- V+ V- OUT
XU4 0 N043 +15v -15v Z LT1057  ; pins In+ In- V+ V- OUT
R1 N019 N015 100k tol=1
R3 N006 N027 10k tol=1
R4 N029 N027 10k tol=1
R5 N019 N027 200k tol=1
R2 N006 N015 100k tol=1
C1 N015 X .1µ
C2 N027 -Y .1µ
C3 N043 Z .1µ
R6 N045 N043 10k tol=1
R7 N039 N043 499k tol=1
V1 +15v 0 15v
V2 -15v 0 -15v
XU1 N006 0 0 Z -15v 0 N029 +15v AD633_JT
XU5 -Y 0 N006 0 -15v 0 N045 +15v AD633_JT
V3 5v 0 5v
XU7 X N008 +15v -15v N009 LT1057  ; pins In+ In- V+ V- OUT
XU8 N020 N013 +15v -15v N014 LT1057  ; pins In+ In- V+ V- OUT
R8 N008 0 100k
R9 N009 N008 15k
R10 N013 0 100k
R11 N014 N013 75k
R12 X N020 100k
R13 N020 0 100k
V4 msg 0 PULSE(0 5 0 1n 1n 1 2 20)
XU10 -Y N023 +15v -15v N024 LT1057  ; pins In+ In- V+ V- OUT
XU11 N035 N030 +15v -15v N031 LT1057  ; pins In+ In- V+ V- OUT
R14 N023 0 100k
R15 N024 N023 15k
R16 N030 0 100k
R17 N031 N030 75k
R18 -Y N035 100k
R19 N035 0 100k
XU13 Z N037 +15v -15v N038 LT1057  ; pins In+ In- V+ V- OUT
XU14 N051 N047 +15v -15v N048 LT1057  ; pins In+ In- V+ V- OUT
R20 N037 0 100k
R21 N038 N037 15k
R22 N047 0 100k
R23 N048 N047 75k
R24 Z N051 100k
R25 N051 0 100k
S1 N006 N009 m 0 MSW
A1 m 0 0 0 0 notm 0 0 BUF Vhigh = 5 Vlow = 0 Ref=1.5 Trise = 1n Tfall = 1n Td =1n
S2 N006 N014 notm 0 MSW
S3 N019 N024 m 0 MSW
S4 N019 N031 notm 0 MSW
S5 N039 N038 m 0 MSW
S6 N039 N048 notm 0 MSW
XU6 0 0 Z -15v P001 N057 N053 +15v LT1011
R26 N053 P001 1Meg
R27 +15v N053 20k
C4 N057 +15v .003µ
D1 N053 N055 1N4148
D2 N059 N055 1N4148
R28 N055 N059 10k
A2 N055 msg 0 0 0 m 0 0 XOR Vhigh = 5 Vlow = 0 Ref = 1.5
XU9 0 N018 +15v -15v A LT1057  ; pins In+ In- V+ V- OUT
XU12 0 N028 +15v -15v -B LT1057  ; pins In+ In- V+ V- OUT
XU15 0 N044 +15v -15v C LT1057  ; pins In+ In- V+ V- OUT
R29 N021 N018 100k tol=1
R30 N003 N028 10k tol=1
R31 N032 N028 10k tol=1
R32 N021 N028 200k tol=1
R33 N007 N018 100k tol=1
C5 N018 A .1µ
C6 N028 -B .1µ
C7 N044 C .1µ
R34 N046 N044 10k tol=1
R35 N042 N044 499k tol=1
XU16 N003 0 0 C -15v 0 N032 +15v AD633_JT
XU17 -B 0 N003 0 -15v 0 N046 +15v AD633_JT
XU18 A N011 +15v -15v N012 LT1057  ; pins In+ In- V+ V- OUT
XU19 N022 N016 +15v -15v N017 LT1057  ; pins In+ In- V+ V- OUT
R36 N011 0 100k
R37 N012 N011 15k
R38 N016 0 100k
R39 N017 N016 75k
R40 A N022 100k
R41 N022 0 100k
XU20 -B N025 +15v -15v N026 LT1057  ; pins In+ In- V+ V- OUT
XU21 N036 N033 +15v -15v N034 LT1057  ; pins In+ In- V+ V- OUT
R42 N025 0 100k
R43 N026 N025 15k
R44 N033 0 100k
R45 N034 N033 75k
R46 -B N036 100k
R47 N036 0 100k
XU22 C N040 +15v -15v N041 LT1057  ; pins In+ In- V+ V- OUT
XU23 N052 N049 +15v -15v N050 LT1057  ; pins In+ In- V+ V- OUT
R48 N040 0 100k
R49 N041 N040 15k
R50 N049 0 100k
R51 N050 N049 75k
R52 C N052 100k
R53 N052 0 100k
S7 N007 N012 p 0 MSW
A3 p 0 0 0 0 notp 0 0 BUF Vhigh = 5 Vlow = 0 Ref=1.5 Trise = 1n Tfall = 1n Td =1n
S8 N007 N017 notp 0 MSW
S9 N021 N026 p 0 MSW
S10 N021 N034 notp 0 MSW
S11 N042 N041 p 0 MSW
S12 N042 N050 notp 0 MSW
XU24 0 0 C -15v P002 N058 N054 +15v LT1011
R54 N054 P002 1Meg
R55 +15v N054 20k
C8 N058 +15v .003µ
D3 N054 N056 1N4148
D4 N060 N056 1N4148
R56 N056 N060 10k
A4 N056 0 0 0 0 p 0 0 XOR Vhigh = 5 Vlow = 0 Ref = 1.5
XU25 X N001 +15v -15v N002 LT1057  ; pins In+ In- V+ V- OUT
XU26 N010 N004 +15v -15v N005 LT1057  ; pins In+ In- V+ V- OUT
R57 N001 0 100k
R58 N002 N001 15k
R59 N004 0 100k
R60 N005 N004 75k
R61 X N010 100k
R62 N010 0 100k
S13 N003 N002 p 0 MSW
S14 N003 N005 notp 0 MSW
.model D D
.lib standard.dio
.tran 0 40 0 .001
***********************************************************************************
**** SPICE MODELING OF AD633 by JIM THOMPSON, http://www.analog-innovations.com/ © 2014 ****
***********************************************************************************
***** Rudimentary Behavioral Model of Analog Devices AD633 Analog Multiplier ******
***** Noise, CMRR and Feed-Thru are not modeled
***********************************************************************************
*** Per Pin Name X1 X2 Y1 Y2 -VS Z  W +VS ***
***              |  |  |  |   |  |  |  |  ***
.SUBCKT AD633_JT 1  2  3  4   5  6  7  8
G_GX1        1 5 VALUE { (1+TANH(22*(V(1,5)-2)))/2*V(ITEMP) }
G_GX2        2 5 VALUE { (1+TANH(22*(V(2,5)-2)))/2*V(ITEMP) }
G_GY1        3 5 VALUE { (1+TANH(22*(V(3,5)-2)))/2*V(ITEMP) }
G_GY2        4 5 VALUE { (1+TANH(22*(V(4,5)-2)))/2*V(ITEMP) }
G_GZ         6 5 VALUE { (1+TANH(22*(V(6,5)-2)))/2*V(ITEMP) }
RCON_TAG3    7 0 1G
E_E1         ITEMP 0 VALUE { 1nA*(489.9-2.0842*TEMP+4.3472m*TEMP*TEMP) }
G_G1         N_1 7 VALUE { 30mA*TANH(450*V(N_2, 7))*V(BOUNDS) }
C_C1         N_2 0  100pF
G_GIQ        8 5 VALUE { (1+TANH(22*(V(8,5)-2)))/2*4mA }
R_RNOF2      7 5  1G
C_COUT       7 5  5pF
E_E3         BOUNDS 0 VALUE {
+  (1+TANH(25*(V(8,7)-2.2)))*(1+TANH(25*(V(7,5)-2.2)))/4 }
R_R1         WINT N_2  1.59155K
E_E2         WINT 0 VALUE { V(1,2)*V(3,4)/10+V(6) }
.MODEL       D D
D_D1         N_3 N_4 D
F_F1         N_3 8 VF_F1 1
VF_F1        8 N_1 0
D_D2         8 N_3 D
R_RNOF1      8 7  1G
F_F2         8 5 VF_F2 1
VF_F2        N_4 8 0
C_C2         6 5  4pF
C_C3         4 5  4pF
C_C4         3 5  4pF
C_C5         2 5  4pF
C_C6         1 5  4pF
.ENDS   AD633_JT
***********************************************************************************
* AD633_JT
* PIN ASSIGNMENT
* PIN1     X1          PIN5     -Vs
* PIN2     X2          PIN6       Z
* PIN3     Y1          PIN7       W
* PIN4     Y2          PIN8     +Vs
.model MSW SW(Ron=1 Roff=100Meg Vt=1 Vh=0)
.lib LTC.lib
.lib LTC1.lib
.backanno
.end